# EAGLE design cBlocks Board_E7_EFS_2v0 (EAGLE 7.7.0)
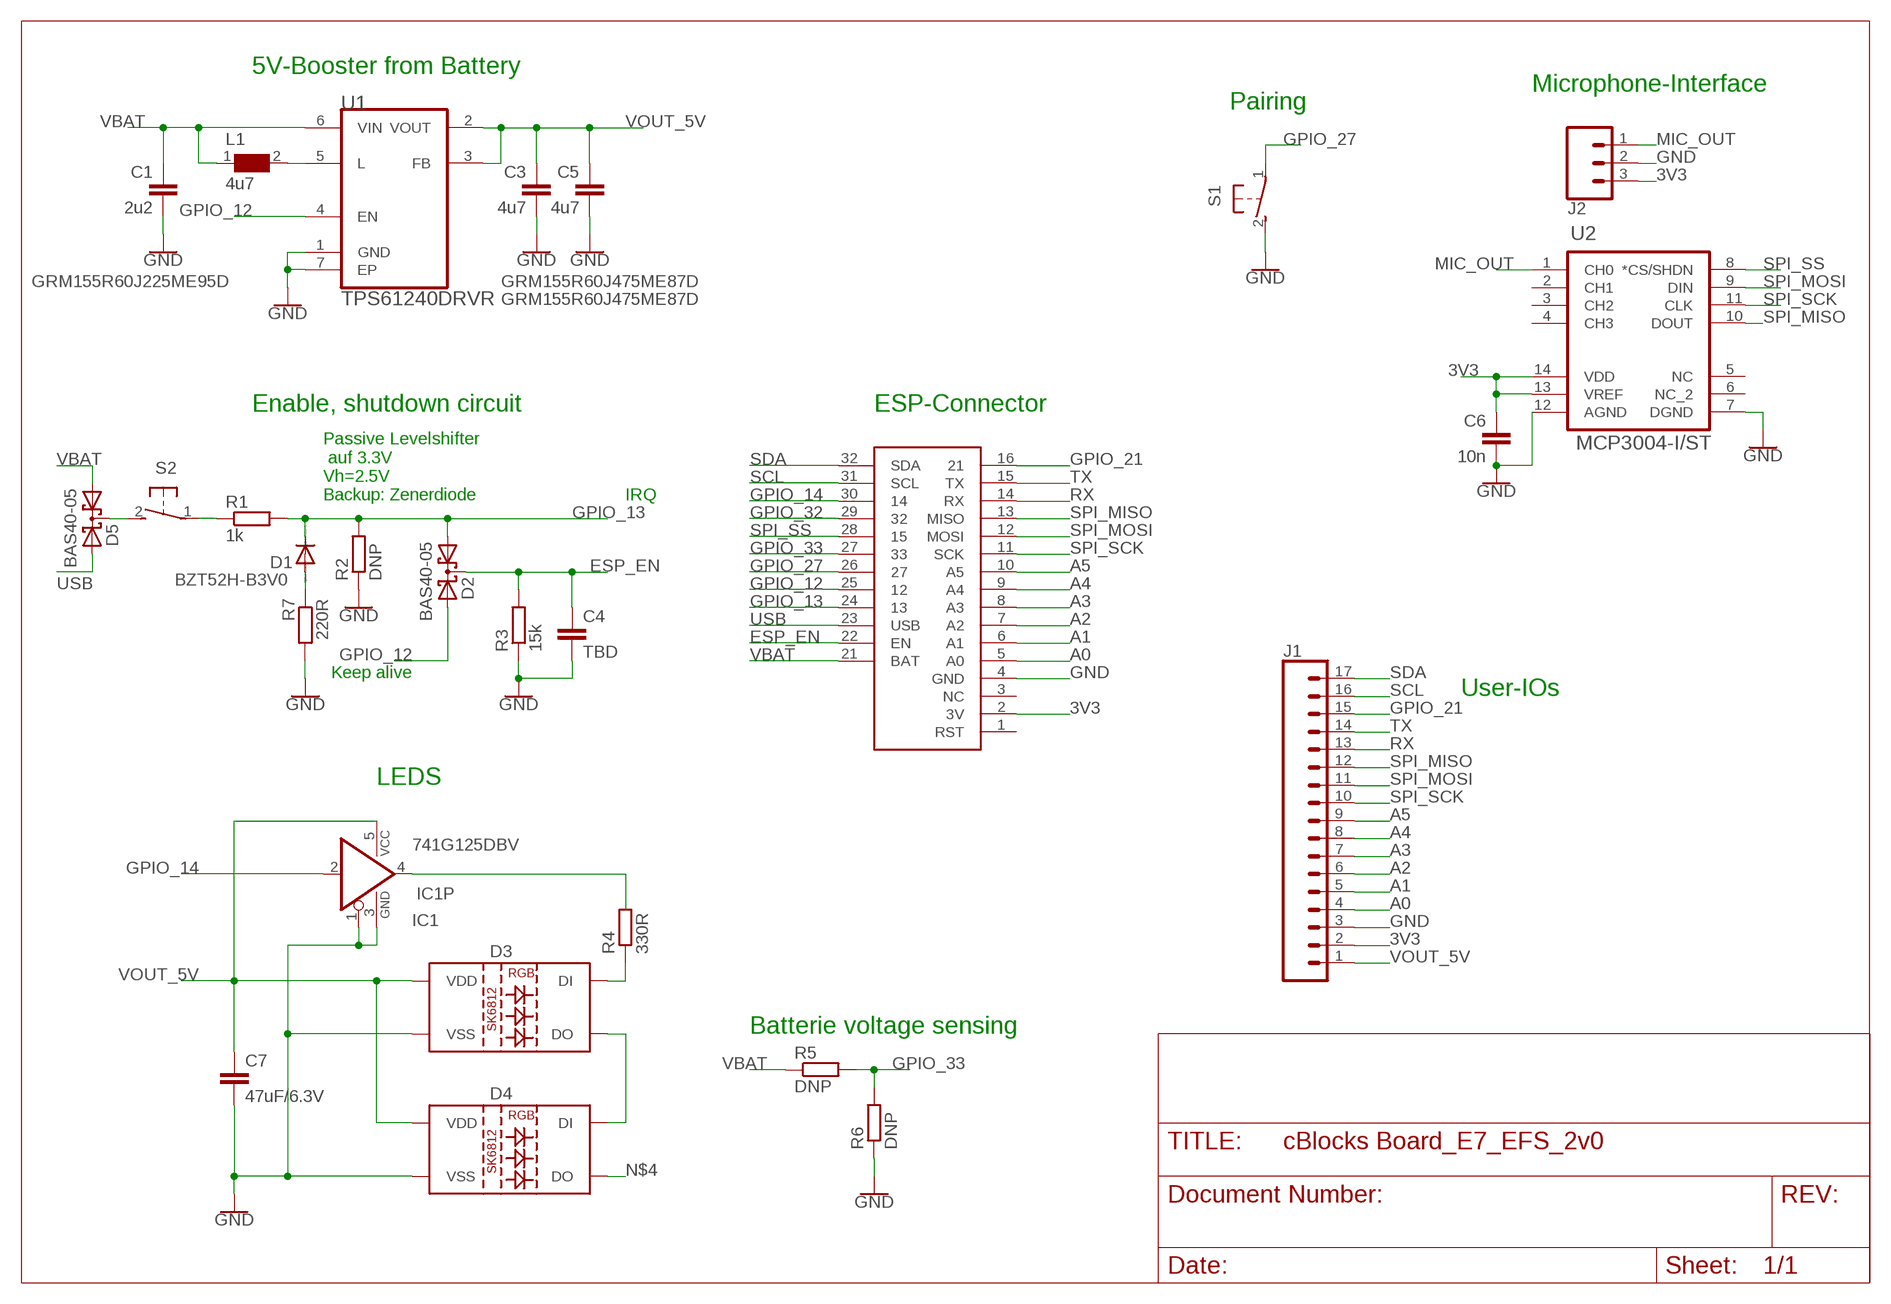
[diagram p0: schematic, sheet 1]

## Parts
C1  2u2  C-EUC0402K  [C0402K]
C3  4u7  C-EUC0402K  [C0402K]
C4  TBD  C-EUC0805  [C0805]
C5  4u7  C-EUC0402K  [C0402K]
C6  10n  C-EUC0805  [C0805]
C7  47uF/6.3V  C-EUC1206K  [C1206K]
D1  BZT52H-B3V0  DIODE-SOD123  [SOD123]
D2  BAS40-05  [SOT23]
D3  SK2812SIDE  [SK2812SIDE]
D4  SK2812SIDE  [SK2812SIDE]
D5  BAS40-05  [SOT23]
IC1  741G125DBV  [SOT353]
IC2  FEATHERESP32  [FEATHERESP32]
J1  CONN_17  [1X17]
J2  CONN_03  [1X03]
L1  4u7  WE-PMI-74479776247_0806  [WE-PMI_0806]
R1  1k  R-EU_R0805  [R0805]
R2  DNP  R-EU_R0805  [R0805]
R3  15k  R-EU_R0805  [R0805]
R4  330R  R-EU_R0805  [R0805]
R5  DNP  R-EU_R0805  [R0805]
R6  DNP  R-EU_R0805  [R0805]
R7  220R  R-EU_R0805  [R0805]
S1  31-XX  [B3F-31XX]
S2  31-XX  [B3F-31XX]
U1  TPS61240DRVR  [SON65P200X200X80-7N]
U2  MCP3004-I/ST  [SO14]

## Nets
3V3: C6.1 IC2.2(3V) J1.2 J2.3 U2.13(VREF) U2.14(VDD)
A0: IC2.5(A0) J1.4
A1: IC2.6(A1) J1.5
A2: IC2.7(A2) J1.6
A3: IC2.8(A3) J1.7
A4: IC2.9(A4) J1.8
A5: IC2.10(A5) J1.9
ESP_EN: C4.1 D2.3(C) IC2.22(EN) R3.2
GND: C1.2 C3.2 C4.2 C5.2 C6.2 C7.2 D3.4(VSS) D4.4(VSS) IC1.1(OE) IC1.3(GND) IC2.4(GND) J1.3 J2.2 R2.1 R3.1 R6.1 R7.2 S1.2(S) U1.1(GND) U1.7(EP) U2.7(DGND) U2.12(AGND)
GPIO_12: D2.2(A2) IC2.25 U1.4(EN)
GPIO_13: D1.C D2.1(A1) IC2.24 R1.2 R2.2
GPIO_14: IC1.2(I) IC2.30
GPIO_21: IC2.16 J1.15
GPIO_27: IC2.26 S1.1(P)
GPIO_32: IC2.29
GPIO_33: IC2.27 R5.2 R6.2
MIC_OUT: J2.1 U2.1(CH0)
N$1: D1.A R7.1
N$2: L1.2 U1.5(L)
N$3: D3.1(DI) R4.1
N$4: D4.3(DO)
N$5: R1.1 S2.1(P)
N$6: D3.3(DO) D4.1(DI)
N$7: IC1.4(O) R4.2
N$8: D5.3(C) S2.2(S)
RX: IC2.14(RX) J1.13
SCL: IC2.31(SCL) J1.16
SDA: IC2.32(SDA) J1.17
SPI_MISO: IC2.13(MISO) J1.12 U2.10(DOUT)
SPI_MOSI: IC2.12(MOSI) J1.11 U2.9(DIN)
SPI_SCK: IC2.11(SCK) J1.10 U2.11(CLK)
SPI_SS: IC2.28 U2.8(*CS/SHDN)
TX: IC2.15(TX) J1.14
USB: D5.2(A2) IC2.23(USB)
VBAT: C1.1 D5.1(A1) IC2.21(BAT) L1.1 R5.1 U1.6(VIN)
VOUT_5V: C3.1 C5.1 C7.1 D3.2(VDD) D4.2(VDD) IC1.5(VCC) J1.1 U1.2(VOUT) U1.3(FB)
Unconnected: IC2.1(RST) IC2.3(NC) U2.2(CH1) U2.3(CH2) U2.4(CH3) U2.5(NC) U2.6(NC_2)

## Notes on the sheet
- 5V-Booster from Battery
- Microphone-Interface
- Pairing
- Enable, shutdown circuit | ESP-Connector
- Passive Levelshifter
   auf 3.3V
  Vh=2.5V
  Backup: Zenerdiode
- IRQ
- Keep alive
- User-IOs
- LEDS
- Batterie voltage sensing

## Library data of the parts
C1 = resistor:C-EU: CAPACITOR, European symbol; OC_FARNELL: 2362091; OC_MFG: GRM155R60J225ME95D
C3 C5 = resistor:C-EU: CAPACITOR, European symbol; OC_FARNELL: 2362092; OC_MFG: GRM155R60J475ME87D
C4 C6 = resistor:C-EU: CAPACITOR, European symbol
C7 = rcl:C-EU: CAPACITOR, European symbol; OC_FARNEL: 1432351
D1 = diode:DIODE-: DIODE; OC_FARNELL: 2069435
D2 D5 = diode:BAS40-05: Silicon Schottky Diodes General-purpose diode for high-speed switching; OC_FARNELL: 2787825
D3 D4 = EFS_mechanical:SK2812SIDE: 4020 RGB Side Firing LEDs with Integerated Driver Chip SK6812 Artikelnummer: LED0006-10
IC1 = EFS_nexperia:74*1G125: Single Bus Buffer Gate with 3-State Output; OC_FARNELL: 1085267
IC2 = EFS_mechanical:FEATHERESP32
J1 = SparkFun-Connectors:CONN_17: Multi connection point. Often used as Generic Header-pin footprint for 0.1 inch spaced/style header connections On any of the 0.1 inch spaced packages, you can populate with these: Break Away Headers - Straight <https://www.sparkfun.com/products/116> (PRT-00116) Break Away Male Headers - Right Angle <https://www.sparkfun.com/products/553> (PRT-00553) Female Headers <https://www.sparkfun.com/products/115> (PRT-00115) Break Away Headers - Machine Pin <https://www.sparkfun.com/products/117> (PRT-00117) Break Away Female Headers - Swiss Machine Pin <https://www.sparkfun.com/products/743> (PRT-00743) For SCREWTERMINALS and SPRING TERMINALS visit here: Screw Terimnals on SparkFun.com <https://www.sparkfun.com/search/results?term=Screw+Terminals> (5mm/3.5mm/2.54mm spacing) This device is also useful as a general connection point to wire up your design to another part of your project. Our various solder wires solder well into these plated through hole pads. Hook-Up Wire - Assortment (Stranded, 22 AWG) <https://www.sparkfun.com/products/11375> (PRT-11375) Hook-Up Wire - Assortment (Solid Core, 22 AWG) <https://www.sparkfun.com/products/11367> (PRT-11367) View the entire wire category on our website here <https://www.sparkfun.com/categories/141> Special notes: Molex polarized connector foot print use with SKU : PRT-08231 with associated crimp pins and housings. 1MM SMD Version SKU: PRT-10208 NOTES ON THE VARIANTS LOCK and LOCK_LONGPADS... This footprint was designed to help hold the alignment of a through-hole component (i.e. 6-pin header) while soldering it into place. You may notice that each hole has been shifted either up or down by 0.005 of an inch from it's more standard position (which is a perfectly straight line). This slight alteration caused the pins (the squares in the middle) to touch the edges of the holes. Because they are alternating, it causes a "brace" to hold the component in place. 0.005 has proven to be the perfect amount of "off-center" position when using our standard breakaway headers. Although looks a little odd when you look at the bare footprint, once you have a header in there, the alteration is very hard to notice. Also,if you push a header all the way into place, it is covered up entirely on the bottom side.
J2 = SparkFun-Connectors@1:CONN_03: Multi connection point. Often used as Generic Header-pin footprint for 0.1 inch spaced/style header connections On any of the 0.1 inch spaced packages, you can populate with these: Break Away Headers - Straight <https://www.sparkfun.com/products/116> (PRT-00116) Break Away Male Headers - Right Angle <https://www.sparkfun.com/products/553> (PRT-00553) Female Headers <https://www.sparkfun.com/products/115> (PRT-00115) Break Away Headers - Machine Pin <https://www.sparkfun.com/products/117> (PRT-00117) Break Away Female Headers - Swiss Machine Pin <https://www.sparkfun.com/products/743> (PRT-00743) Stackable Header - 3 Pin (Female, 0.1") <https://www.sparkfun.com/products/13875> (PRT-13875) For SCREWTERMINALS and SPRING TERMINALS visit here: Screw Terimnals on SparkFun.com <https://www.sparkfun.com/search/results?term=Screw+Terminals> (5mm/3.5mm/2.54mm spacing) This device is also useful as a general connection point to wire up your design to another part of your project. Our various solder wires solder well into these plated through hole pads. Hook-Up Wire - Assortment (Stranded, 22 AWG) <https://www.sparkfun.com/products/11375> (PRT-11375) Hook-Up Wire - Assortment (Solid Core, 22 AWG) <https://www.sparkfun.com/products/11367> (PRT-11367) View the entire wire category on our website here <https://www.sparkfun.com/categories/141> Special notes: Molex polarized connector foot print use with SKU : PRT-08232 with associated crimp pins and housings.; PROD_ID: XXX-00000; VALUE: 455-1750-1-ND
L1 = WE-PMI:WE-PMI: Power Multilayer Inductor WE-PMI - Compact multilayer type - Suitable for applocations with high currents up to 2.5 A - No crosstalk -- DC / DC converters especially at high switching frequencies -- Portable devices like PDA and digital cameras; MPN: 74479776247; OC_FARNELL: 1869753; OC_NEWARK: 32T8586; PACKAGE: 0806; SUPPLIER: WURTH ELEKTRONIK
R1-R7 = resistor:R-EU_: RESISTOR, European symbol
S1 S2 = switch-omron:31-XX: OMRON SWITCH; MPN: B3F-3120; OC_FARNELL: 1608275; OC_NEWARK: 36M3582
U1 = EFS_TI:TPS61240DRVR: 3.5-MHz High Efficiency Step-Up Converter; MPN: TPS61240DRVR; OC_FARNELL: 1903400; PACKAGE: SON-6; SUPPLIER: Texas Instruments
U2 = EFS_microchip:MCP3004-I/ST: IC, 10BIT ADC 4-CH, SMD; OC_FARNELL: 1852016

## Board
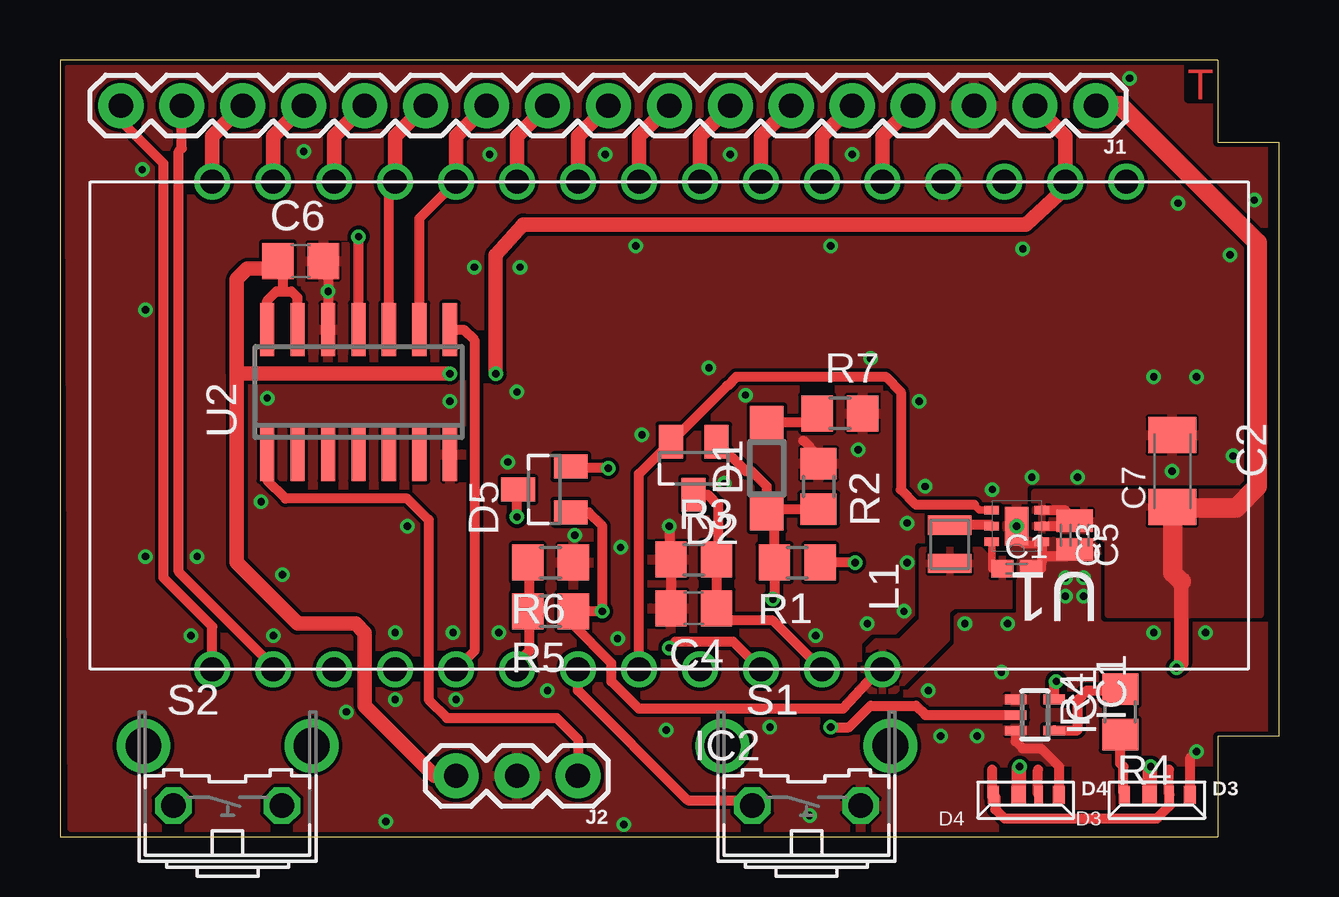
[diagram p1: board, top side]
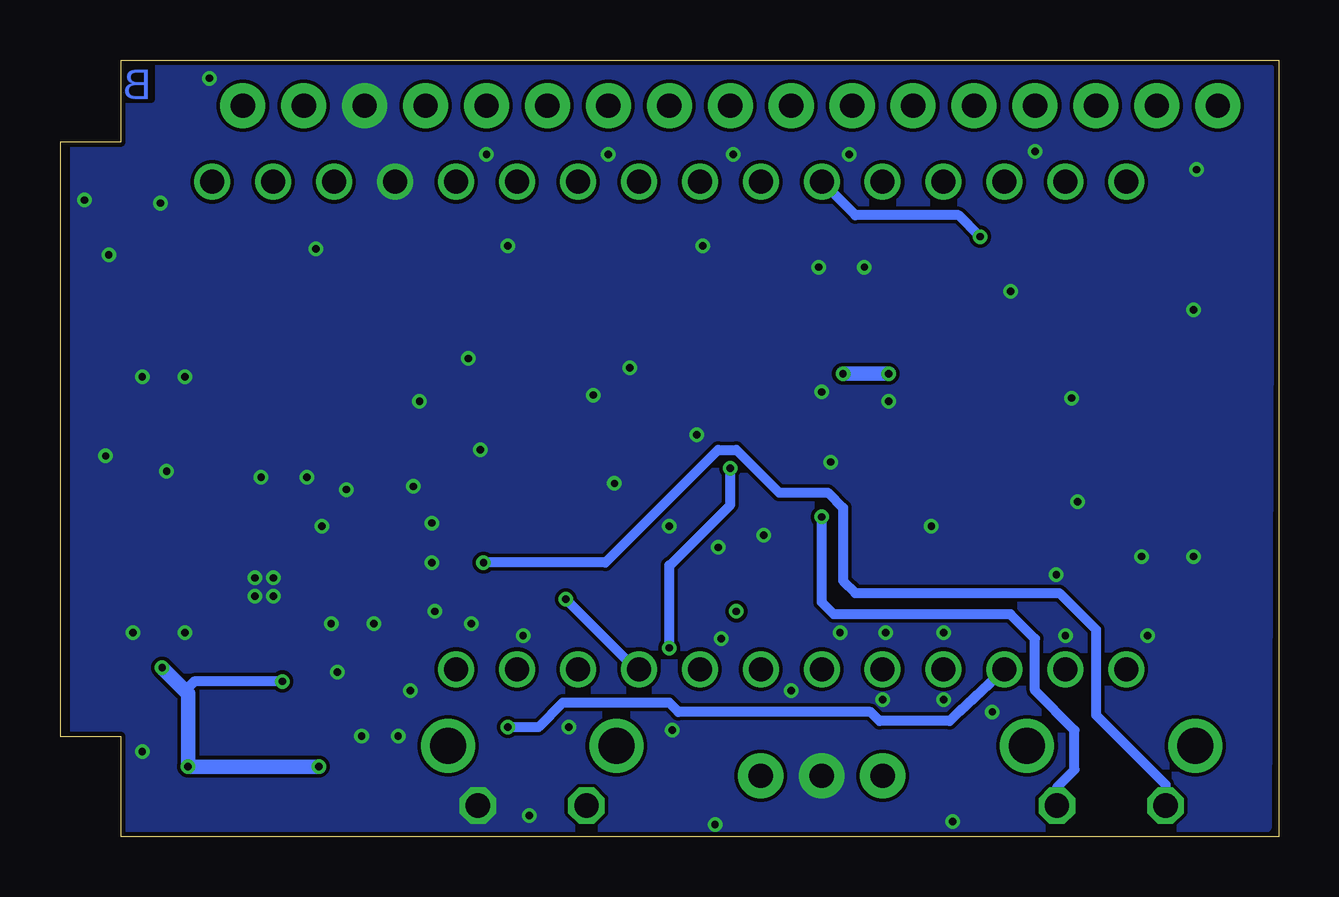
[diagram p2: board, bottom side, seen from below]

Size 50.8 x 32.38 mm. Coordinates in mm from the lower left corner, seen from the top.
Outline: 0,0 48.26,0 48.26,4.19 50.8,4.19 50.8,28.96 48.26,28.96 48.26,32.38 0,32.38 0,0
Copper layers (1*16): Top 0.018mm / dielectric 1.55mm / Bottom 0.018mm
Design rules "Fischer_zweilagig": minimum track width 0.15mm, minimum drill 0.3mm, track to track 0.15mm, track to pad 0.15mm, pad to pad 0.15mm, via to via 0.15mm, smd to smd 0mil, copper to edge 0.2mm, drill to drill 0.2mm, minimum pad ring 0.15mm, minimum via ring 0.15mm, stop-mask expansion 2mil, vias tented up to drill 0.45mm, thermal gap 0.1mm
tKeepout: area 14.1,0.9 to 24.5,4.2
tRestrict: area 41,1.1 to 42.2,2.9; area 46.7,1.1 to 47.9,2.9

### Footprints (pad centres in the part's own frame; a part is rotated, then mirrored left to right if it is on the bottom)
C0402K = smd 0.925 x 0.74: 1 -0.6,0; 2 0.6,0
C0805 = smd 1.3 x 1.5: 1 -0.95,0; 2 0.95,0
C1206K = smd 1.5 x 2: 1 -1.5,0; 2 1.5,0
SOD123 = smd 1.4 x 1.4: A 1.9,0; C -1.9,0
SOT23 = smd 1 x 1.4: 1 -0.95,-1.1; 2 0.95,-1.1; 3 0,1.1
SK2812SIDE = smd 0.45 x 0.75: 1 -1.35,0.235 | smd 0.6 x 0.75: 2 -0.3,0.235 | smd 0.35 x 0.75: 3 0.525,0.235 | smd 0.5 x 0.75: 4 1.375,0.235
SOT353 = smd 0.4 x 0.9: 1 -0.65,-0.8; 2 0,-0.8; 3 0.65,-0.8; 4 0.65,0.8; 5 -0.65,0.8
FEATHERESP32 = drill 1: 1 -19.05,-10.16; 2 -16.51,-10.16; 3 -13.97,-10.16; 4 -11.43,-10.16; 5 -8.89,-10.16; 6 -6.35,-10.16; 7 -3.81,-10.16; 8 -1.27,-10.16; 9 1.27,-10.16; 10 3.81,-10.16; 11 6.35,-10.16; 12 8.89,-10.16; 13 11.43,-10.16; 14 13.97,-10.16; 15 16.51,-10.16; 16 19.05,-10.16; 21 -8.89,10.16; 22 -6.35,10.16; 23 -3.81,10.16; 24 -1.27,10.16; 25 1.27,10.16; 26 3.81,10.16; 27 6.35,10.16; 28 8.89,10.16; 29 11.43,10.16; 30 13.97,10.16; 31 16.51,10.16; 32 19.05,10.16
1X17 = drill 1.016 pad 1.88: 1 0,0; 2 2.54,0; 3 5.08,0; 4 7.62,0; 5 10.16,0; 6 12.7,0; 7 15.24,0; 8 17.78,0; 9 20.32,0; 10 22.86,0; 11 25.4,0; 12 27.94,0; 13 30.48,0; 14 33.02,0; 15 35.56,0; 16 38.1,0; 17 40.64,0
1X03 = drill 1.016 pad 1.88: 1 0,0; 2 2.54,0; 3 5.08,0
WE-PMI_0806 = smd 0.8 x 1.8: 1 -0.8,0; 2 0.8,0
R0805 = smd 1.3 x 1.5: 1 -0.95,0; 2 0.95,0
B3F-31XX = drill 1.016 octagon: 1 -2.261,-1.245; 2 2.261,-1.245 | drill 1.499 pad 2.159: 3 -3.505,1.245; 4 3.505,1.245
SON65P200X200X80-7N = smd 0.61 x 0.356: 1 -1.041,0.66; 2 -1.041,0; 3 -1.041,-0.66; 4 1.041,-0.66; 5 1.041,0; 6 1.041,0.66 | smd 0.991 x 1.6: 7 0,0
SO14 = smd 0.6 x 2.2: 1 -3.81,-2.6; 2 -2.54,-2.6; 3 -1.27,-2.6; 4 0,-2.6; 5 1.27,-2.6; 6 2.54,-2.6; 7 3.81,-2.6; 8 3.81,2.6; 9 2.54,2.6; 10 1.27,2.6; 11 0,2.6; 12 -1.27,2.6; 13 -2.54,2.6; 14 -3.81,2.6

### Placement (x,y rotation side)
C1  39.88,11.18 0 top
C3  41.91,12.57 270 top
C4  26.42,9.53 180 top
C5  42.67,12.57 270 top
C6  10.03,24 0 top
C7  46.35,15.24 90 top
D1  29.46,15.37 90 top
D2  26.42,15.37 180 top
D3  45.72,1.52 0 top
D4  40.26,1.52 0 top
D5  20.19,14.48 90 top
IC1  40.64,5.08 270 top
IC2  25.4,17.14 180 top
J1  43.18,30.48 180 top
J2  21.59,2.54 180 top
L1  37.08,12.19 90 top
R1  30.73,11.43 180 top
R2  31.62,14.61 270 top
R3  26.42,11.56 0 top
R4  44.2,5.21 90 top
R5  20.45,9.4 180 top
R6  20.45,11.43 180 top
R7  32.51,17.65 0 top
S1  31.11,2.54 0 top
S2  6.99,2.54 0 top
U1  39.88,12.95 180 top
U2  12.45,18.54 0 top

### Tracks (layer width: path | path; a pad name or v marks a point on that pad's centre or on a via)
3V3  (via drill 0.3)
  Top 0.406: C6.1 8.64,23.68 9.27,23.68 9.27,22.73 | U2.13 9.91,22.48 9.65,22.73 9.27,22.73 | U2.14 8.64,22.35 9.02,22.73 9.27,22.73
  Top 0.61: J1.2 41.91,29.21 IC2.2 41.91,27.05 40.26,25.53 19.3,25.53 18.16,24.26 v18.16,19.3 | v16.26,19.3 7.37,19.3 | 7.37,19.3 7.37,23.24 7.81,23.68 8.64,23.68 | J2.3 15.62,2.54 12.7,5.46 12.7,8.51 12.32,8.89 9.91,8.89 7.37,11.43 7.37,19.3
  Bottom 0.61: v18.16,19.3 v16.26,19.3
A0
  Top 0.61: IC2.5 34.29,29.21 J1.4
A1
  Top 0.61: IC2.6 31.75,29.21 J1.5
A2
  Top 0.61: IC2.7 29.21,29.21 J1.6
A3
  Top 0.61: IC2.8 26.67,29.21 J1.7
A4
  Top 0.61: IC2.9 24.13,29.21 J1.8
A5
  Top 0.61: IC2.10 21.59,29.21 J1.9
ESP_EN
  Top 0.406: D2.3 27.01,14.27 27.43,13.84 27.43,11.62 R3.2 C4.1 27.87,9.02 29.72,9.02 IC2.22
GND  (via drill 0.3)
  Top 0.305: 38.29,4.13 v38.23,4.19 | U1.1 40.92,12.19 40.26,12.19 arc-90 39.88,12.57 U1.7 | 39.35,6.75 arc90 v39.24,6.86
  Top 0.406: v25.4,12.95 25.4,11.62 R3.1 C4.2 | R2.1 31.62,15.88 30.99,16.51 | U1.1 40.92,11.68 | 40.92,11.68 40.92,11.43 40.89,11.43 40.89,11.18 C1.2 | C3.2 41.91,11.68 40.92,11.68 | C6.2 11.18,23.68 v11.18,22.73 U2.12 | 21.34,11.43 R6.1 | D4.4 41.66,1.78 41.66,2.92 40.89,3.68 40.13,3.68 39.84,3.98 IC1.3 | D3.4 47.12,1.78 47.12,3.3 v47.37,3.56
  other vias: 41.91,10.79 42.67,10.79 42.67,10.03 41.91,10.03 39.88,12.95 21.46,12.57 8.64,18.29 16.26,18.16 13.97,8.51 20.32,6.1 16.51,5.71 13.97,5.71 25.27,4.45 31.24,0.89 36.7,4.19 36.2,6.1 33.66,8.89 45.59,8.51 47.75,8.51 47.37,19.18 45.59,19.18 46.35,15.24 40.51,14.99 33.78,19.94 27.05,19.56 27.69,14.73 24.26,16.76 19.18,23.75 17.27,23.75 14.48,12.95 18.67,15.62 3.56,11.68 3.56,21.97 3.43,27.81 10.16,28.57 33.02,28.45 27.94,28.45 22.73,28.45 17.91,28.45 44.58,31.62 46.61,26.42 48.77,24.26 40.13,24.51 32.13,24.64 24,24.64 35.18,9.4 37.72,8.89 35.31,13.08 33.27,16.13 35.81,18.16 23.5,0.51 13.59,0.64 5.71,11.68 8.38,13.97 19.05,18.54 11.94,5.21 8.89,8.38 5.46,8.38 49.78,26.54 48.9,15.88 36.07,14.61 38.86,14.48 35.31,11.43 42.42,14.99 39.5,8.89 23.37,12.06 9.27,10.92 16.38,8.51 18.29,8.51 23.24,8.26 31.5,8.38 29.59,4.57 28.57,18.41
  pour Top (no thermals): 40.01,9.91 40.01,12.32 42.93,12.32 43.18,12.06 43.18,9.91
  pour Top (rank 5): 0.51,0.38 50.16,0.38 50.16,32 0.38,32
  pour Bottom (rank 5, no thermals): 0.51,0.38 50.16,0.38 50.16,32 0.38,32
GPIO_12
  Top 0.305: U1.4 38.33,13.61 38.1,13.84
  Top 0.406: 38.1,13.84 35.69,13.84 35.05,14.48 35.05,18.54 34.42,19.18 28.19,19.18 27.81,18.8 27.8,18.8 D2.2 24.13,15.13 IC2.25
GPIO_13  (via drill 0.3)
  Top 0.406: R2.2 29.65,13.65 D1.C | D1.C 29.46,14.61 28.83,15.24 28.59,15.24 D2.1 | D1.C 29.78,13.15 R1.2 29.78,9.97 v29.72,9.91
  Bottom 0.406: IC2.24 26.8,6.99 v29.72,9.91
GPIO_14  (via drill 0.3)
  Top 0.406: v32.13,4.57 32.89,4.57 33.78,5.46 35.69,5.46 36.07,5.08 IC1.2
  Bottom 0.406: IC2.30 13.34,5.21 13.72,4.83 16.64,4.83 17.02,5.21 25.02,5.21 25.4,5.59 29.84,5.59 30.86,4.57 v32.13,4.57
GPIO_21
  Top 0.61: IC2.16 6.35,29.21 J1.15
GPIO_27
  Top 0.406: S1.1 28.63,1.52 26.16,1.52 21.59,6.1 IC2.26
GPIO_33
  Top 0.406: R6.2 19.56,11.43 19.56,9.4 R5.2 19.56,9.27 19.56,7.75 19.05,7.24 IC2.27
MIC_OUT
  Top 0.406: U2.1 8.64,14.86 9.4,14.1 14.48,14.1 15.37,13.21 15.37,5.71 16.13,4.95 20.7,4.95 21.59,4.06 J2.1
N$1
  Top 0.406: R7.1 31.18,17.27 D1.A
N$2
  Top 0.406: U1.5 38.8,12.99 L1.2
N$3
  Top 0.406: D3.1 44.32,1.81 44.32,2.92 44.2,3.05 R4.1
N$4
  Top 0.305: D4.3 40.77,1.78
  Top 0.406: 40.77,1.78 40.77,2.79
N$5  (via drill 0.3)
  Top 0.406: v33.15,11.43 R1.1
  Bottom 0.406: v33.15,11.43 28.07,11.43 23.37,16.13 22.61,16.13 20.83,14.35 18.8,14.35 18.16,13.72 18.16,10.67 17.65,10.16 9.14,10.16 7.62,8.64 7.62,5.08 4.72,2.18 S2.1
N$6
  Top 0.305: D3.3 46.23,1.78
  Top 0.406: D3.3 46.24,1.29 45.72,0.76 39.37,0.76 38.99,1.14 38.99,1.68 D4.1 38.88,1.76 38.86,1.78 | 38.86,1.65 38.86,1.78 | 38.86,1.78 38.86,2.79 | 46.23,1.78 46.23,2.79
N$7
  Top 0.406: IC1.4 arc-90 41.45,4.45 42.42,4.45 42.42,5.71 42.8,6.1 44.13,6.1 R4.2
N$8  (via drill 0.3)
  Top 0.406: v19.05,13.34 19.05,14.44 D5.3
  Bottom 0.406: S2.2 9.25,2.06 8.51,2.79 8.51,4.45 10.16,6.1 10.16,8.26 11.18,9.27 18.54,9.27 19.05,9.78 v19.05,13.34
RX
  Top 0.61: IC2.14 11.43,29.21 J1.13
SCL
  Top 0.406: J1.16 5.08,28.7 4.95,28.57 4.95,11.05 8.89,7.11 IC2.31
SDA
  Top 0.406: IC2.32 6.35,8.76 4.32,10.79 4.32,28.07 2.54,29.84 J1.17
SPI_MISO
  Top 0.406: U2.10 13.72,27.05 IC2.13
  Top 0.61: IC2.13 13.97,29.21 J1.12
SPI_MOSI
  Top 0.406: U2.9 14.99,25.78 IC2.12
  Top 0.61: IC2.12 16.51,29.21 J1.11
SPI_SCK  (via drill 0.3)
  Top 0.406: U2.11 v12.45,25.02
  Top 0.61: IC2.11 19.05,29.21 J1.10
  Bottom 0.406: v12.45,25.02 13.34,25.91 17.65,25.91 IC2.11
SPI_SS
  Top 0.406: U2.8 16.83,21.14 17.27,20.7 17.27,7.75 IC2.28
TX
  Top 0.61: IC2.15 8.89,29.21 J1.14
USB  (via drill 0.3)
  Top 0.406: IC2.23 28.07,8.13 25.65,8.13 v25.4,7.87 | v22.86,15.37 21.35,15.37 D5.2
  Bottom 0.406: v25.4,7.87 25.4,11.32 25.38,11.32 22.86,13.84 v22.86,15.37
VBAT  (via drill 0.3)
  Top 0.305: U1.6 38.84,11.18 C1.1
  Top 0.406: IC2.21 34.16,6.99 32.64,5.33 24.13,5.33 22.99,6.48 22.99,7.24 21.34,8.89 21.34,9.4 R5.1 v22.61,9.4 22.61,12.95 22.03,13.53 D5.1
  pour Top (rank 2): 39.62,11.56 38.73,11.56 38.35,11.94 35.94,11.94 35.94,9.02 35.05,8.13 34.04,8.13 33.53,7.62 33.53,6.35 33.78,6.1 34.8,6.1 36.96,8.26 36.96,9.4 37.21,9.65 39.62,9.65
VOUT_5V  (via drill 0.3)
  Top 0.406: U1.2 41.75,12.95 arc-90 C3.1 41.91,13.59 arc90 41.88,13.61 U1.3 | IC1.5 41.44,6.39 v41.53,6.48
  Top 0.61: 46.74,10.64 46.74,7.24 v46.54,7.05 | D4.2 39.96,2.88 v40.01,2.92 | v45.47,2.92 45.42,2.88 D3.2
  Top 0.813: J1.1 44.2,30.48 49.91,24.77 49.91,14.61 49.02,13.72 46.38,13.72 | 46.38,13.72 C7.1 | 46.38,13.72 46.38,11 46.74,10.64
  Bottom 0.406: v41.53,6.48 45.21,6.48 45.59,6.1
  Bottom 0.61: v46.54,7.05 45.59,6.1 45.47,5.97 v45.47,2.92 v40.01,2.92
  pour Top (rank 3): 50.04,9.27 43.69,9.27 43.69,12.45 40.64,12.45 40.64,14.35 50.04,14.35

### Text on the board
Top: T
Bottom: B
bStop: CB - EFS - 1902 - 2V0
_tNames: J1 | C6 | U2 | C2 | R2 | D1 | R3 | D2 | C3 | C5 | C1 | U1 | R6 | R1 | L1 | R5 | C4 | IC1 | S2 | S1 | IC2 | R4 | J2 | D4 | D3